# EAGLE design SparkFun_LilyPad_Coincell-Battery (EAGLE 7.2.0)
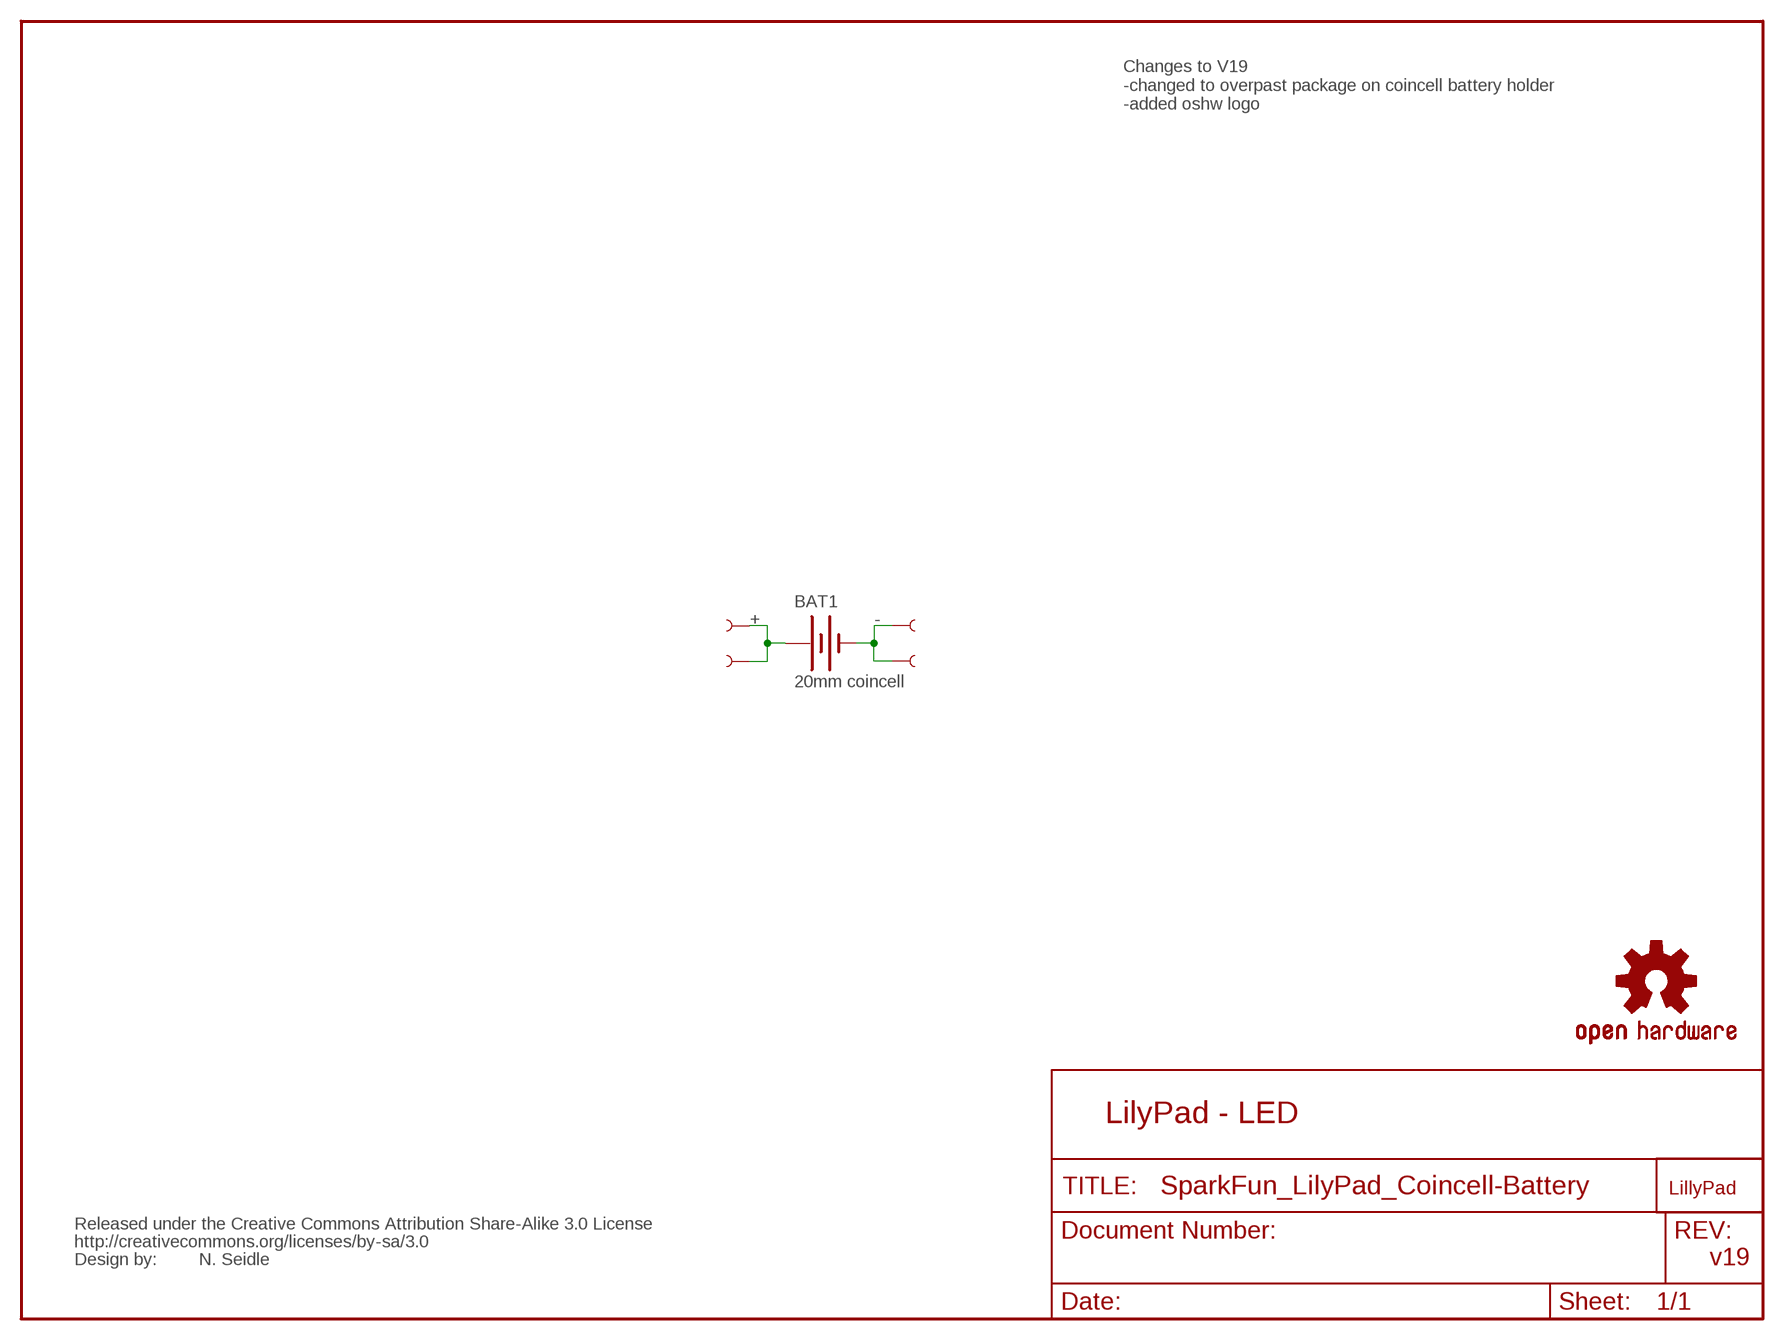
[diagram p0: schematic, sheet 1]

## Parts
BAT1  20mm coincell  BATTERY20MM_4LEGS_OVERPASTE  [BATTCON_20MM_4LEGS_OVERPASTE]
U$1  SEWTAP6  [PETAL-SMALL-2SIDE]
U$2  SEWTAP6  [PETAL-SMALL-2SIDE]
U$3  SEWTAP6  [PETAL-SMALL-2SIDE]
U$4  SEWTAP6  [PETAL-SMALL-2SIDE]
U$5  LOGO-LPLP  [LOGO-LILYPAD]
U$6  CREATIVE_COMMONS  [CREATIVE_COMMONS]
U$7  OSHW-LOGOS  [OSHW-LOGO-S]

## Nets
+: BAT1.1(+) U$2.1 U$4.1
-: BAT1.2(-) U$1.1 U$3.1

## Notes on the sheet
- Changes to V19
  -changed to overpast package on coincell battery holder
  -added oshw logo
- LilyPad - LED
- N. Seidle | v19

## Library data of the parts
BAT1 = SparkFun-Electromechanical:BATTERY: Battery Holders Various common sizes : AA, AAA, 20mm coin cell and 12mm coin cell. 20MM_4LEGS, BATT-10373
U$1-U$4 = LilyPad-Wearables:SEWTAP
U$5 = LilyPad-Wearables:LOGO-LP
U$6 = SparkFun:CREATIVE_COMMONS
U$7 = SparkFun:OSHW-LOGO: Open Source Hardware Logo This logo indicates the piece of hardware it is found on incorporates a OSHW license and/or adheres to the definition of open source hardware found here: http://freedomdefined.org/OSHW

## Board
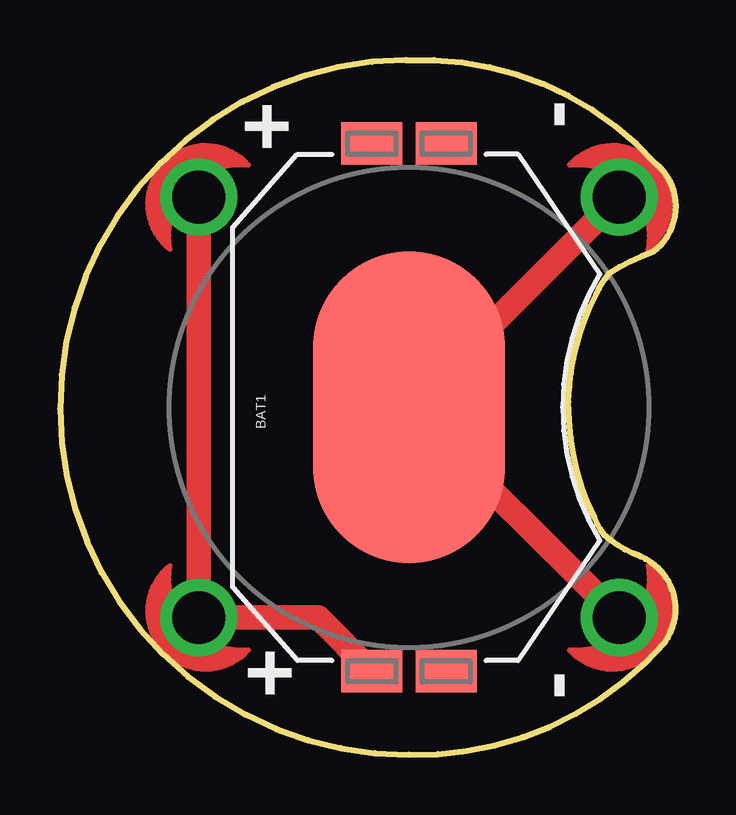
[diagram p1: board, top side]
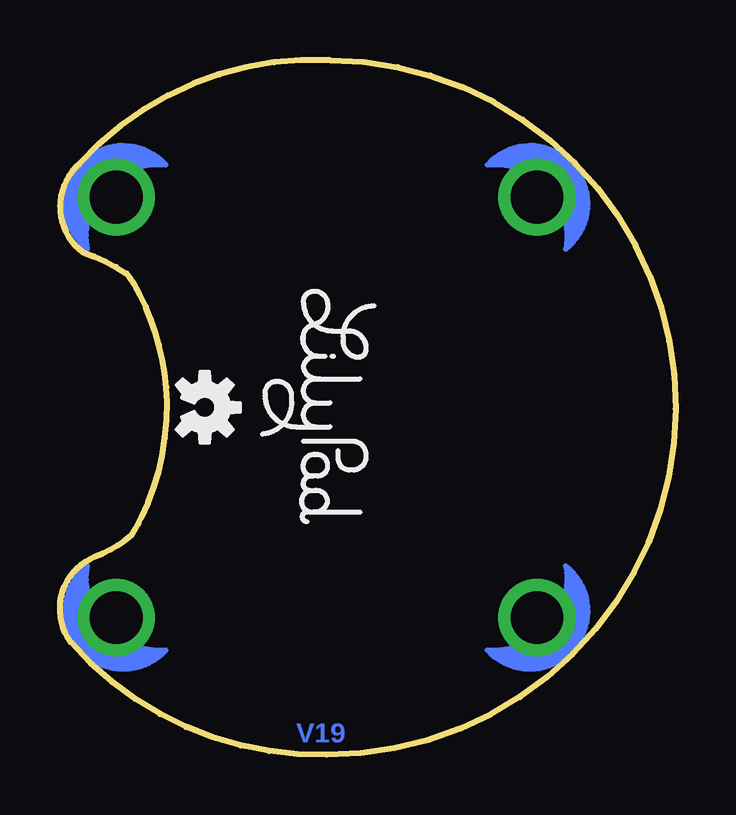
[diagram p2: board, bottom side, seen from below]

Size 25.65 x 28.96 mm. Coordinates in mm from the lower left corner, seen from the top.
Outline: 14.54,0 arc50 25.21,4.7 arc103 24.19,8.25 arc-20 22.67,9.16 arc-11 22.26,9.89 arc-17 21.4,12.46 arc-11 21.18,14.71 arc-13 21.53,17.08 arc-9 22.07,18.67 22.34,19.2 arc-14 22.89,20.07 arc-13 24.7,20.95 arc102 24.83,24.64 arc51 14.41,28.96 arc180 14.54,0
Copper layers (1*16): Top 0.035mm / dielectric 1.5mm / Bottom 0.035mm
Design rules "SparkFun": minimum track width 8mil, minimum drill 20mil, track to track 8mil, track to pad 8mil, pad to pad 8mil, via to via 8mil, smd to smd 8mil, copper to edge 8mil, drill to drill 8mil, minimum pad ring 12mil, minimum via ring 10mil, stop-mask expansion 4mil, vias tented up to drill 20mil, thermal gap 10mil

### Footprints (pad centres in the part's own frame; a part is rotated, then mirrored left to right if it is on the bottom)
BATTCON_20MM_4LEGS_OVERPASTE = smd 1.778 x 2.54: 1 -11,1.55; 3 11,1.55; P$1 -11,-1.55; P$2 11,-1.55 | smd 13 x 8: 2 0,0
PETAL-SMALL-2SIDE = drill 2.2: 1 0,0

### Placement (x,y rotation side)
BAT1  14.54,14.48 90 top
U$1  23.3,5.71 47 top
U$2  5.78,5.71 313 top
U$3  23.3,23.24 133 top
U$4  5.78,23.24 227 top
U$5  14.54,14.48 270 bottom
U$6  -18.48,-9.65 0 top  (outside the outline)
U$7  19.62,14.48 270 bottom

### Tracks (layer width: path | path; a pad name or v marks a point on that pad's centre or on a via)
+
  Top 1.016: 5.65,23.37 U$4.1 U$2.1 10.75,5.71 BAT1.1
-
  Top 1.016: U$3.1 BAT1.2 U$1.1

### Text on the board
Bottom: V19
tPlace: - | + | + | -
tValues: N. Seidle